# Altium project demo_dermis_chip1_package.PrjPcb
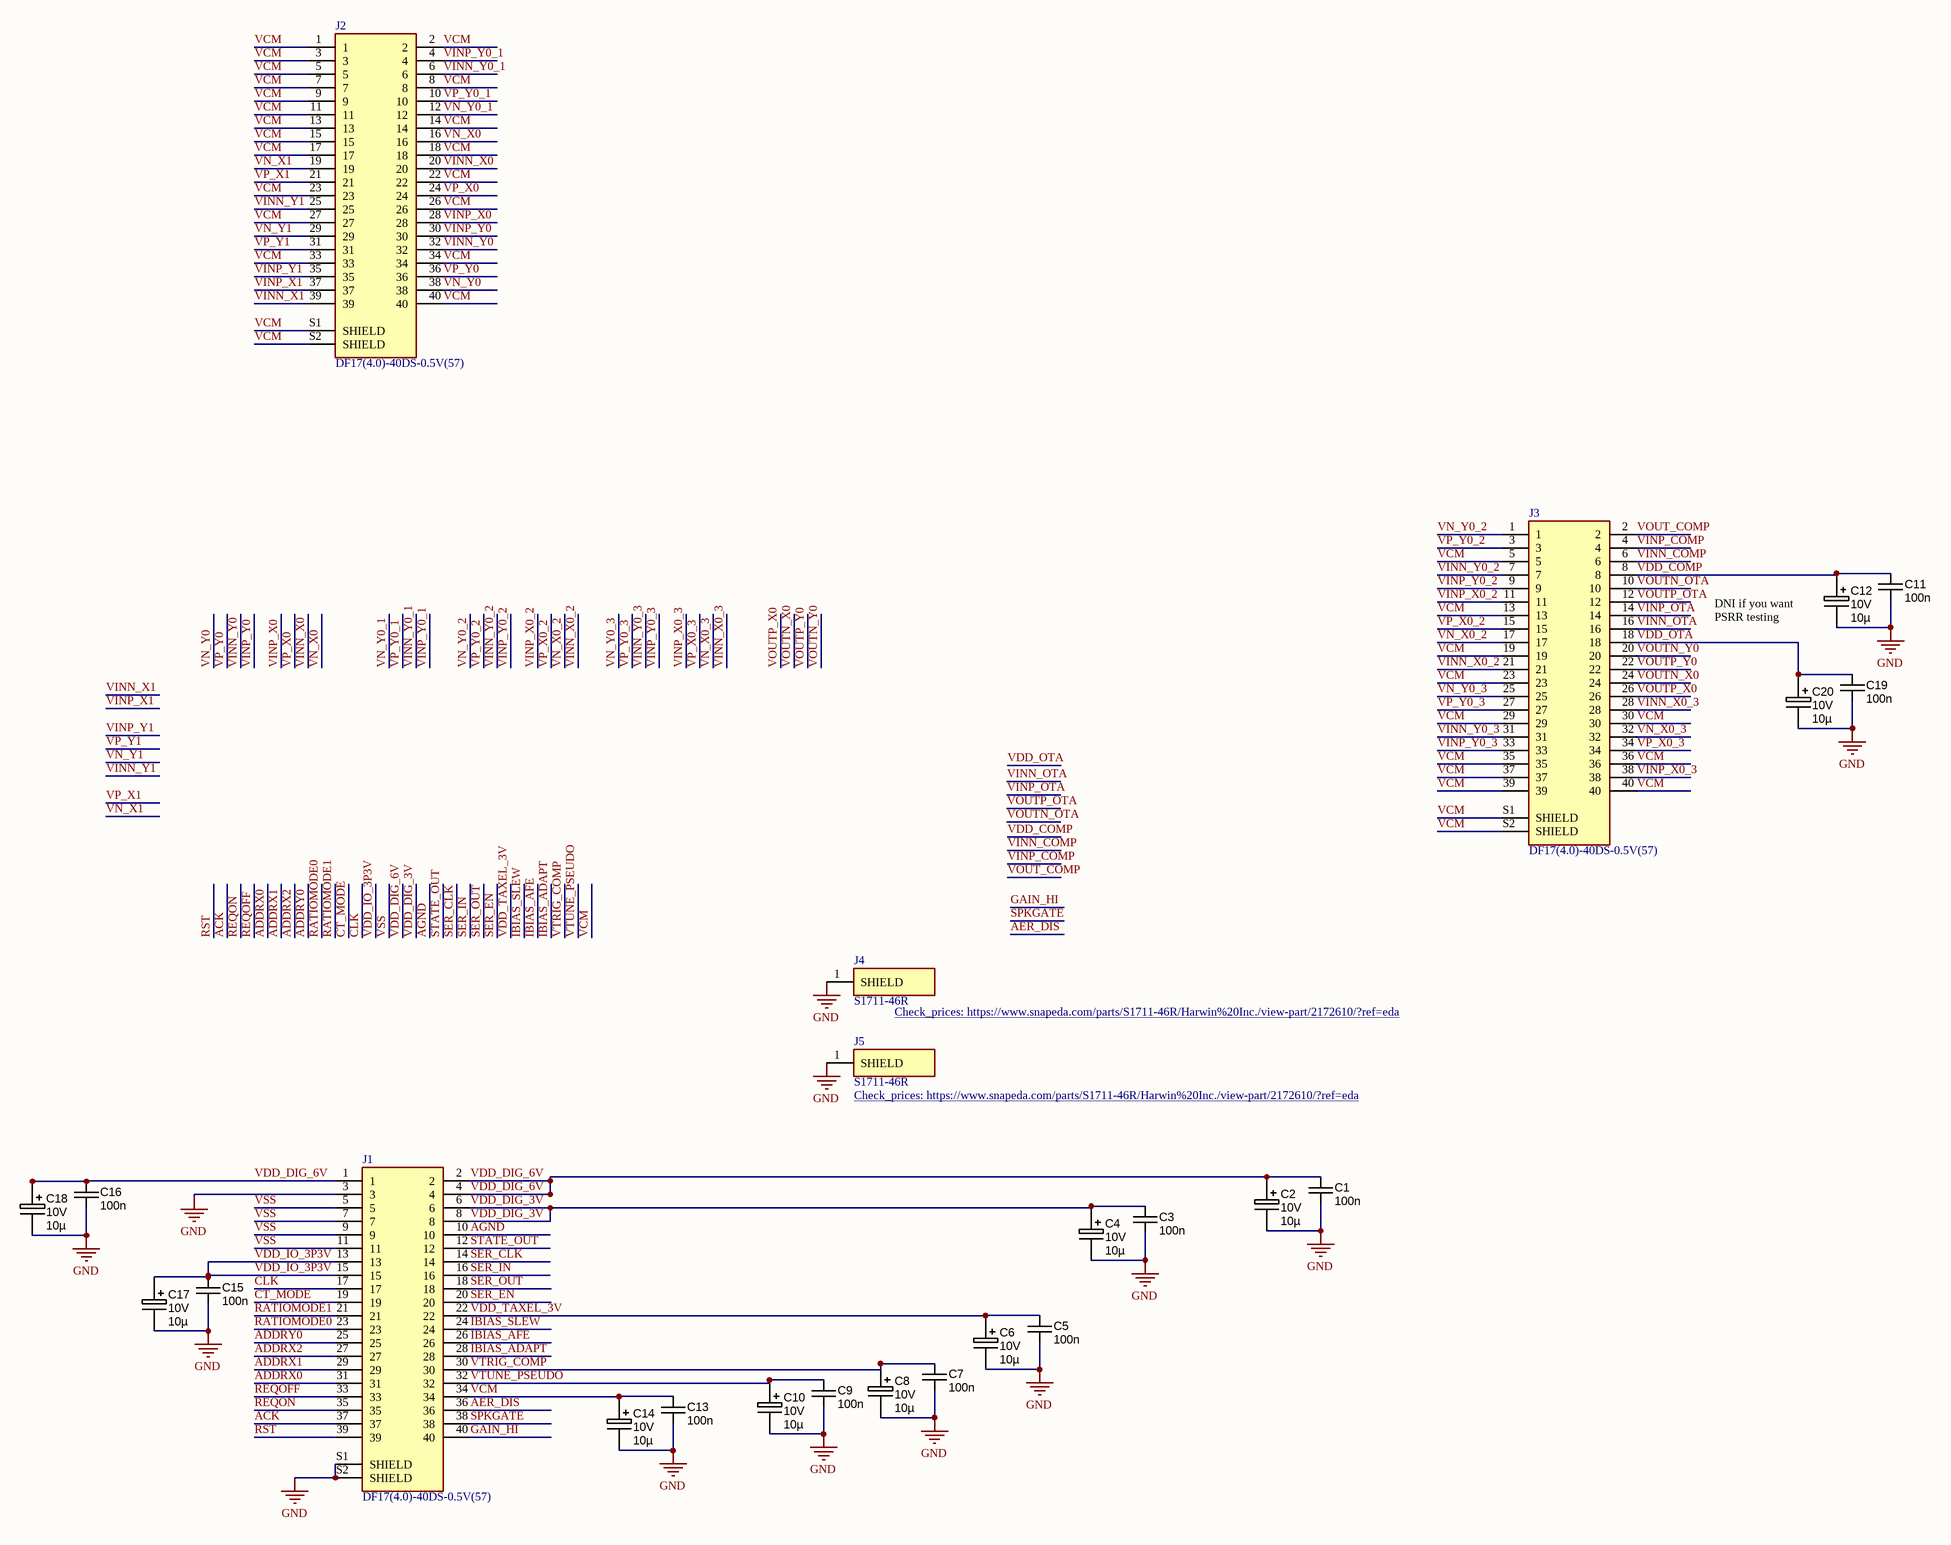
[diagram p0: demo_dermis_chip1_package.SchDoc]
1 sheet, 25 parts. Net scope: global (net labels, ports and power ports of the same name join across sheets).
Board file: demo_dermis_chip1_package.PcbDoc

## Sheet demo_dermis_chip1_package.SchDoc
size C

### Parts
C1  value 100n  [CAPC1608N]  (hidden comment: approved sub OK)
C2  Ratings: 10V  [CAPMP2012X150USR]  (hidden comment: 10µ)
C3  value 100n  [CAPC1608N]  (hidden comment: approved sub OK)
C4  Ratings: 10V  [CAPMP2012X150USR]  (hidden comment: 10µ)
C5  value 100n  [CAPC1608N]  (hidden comment: approved sub OK)
C6  Ratings: 10V  [CAPMP2012X150USR]  (hidden comment: 10µ)
C7  value 100n  [CAPC1608N]  (hidden comment: approved sub OK)
C8  Ratings: 10V  [CAPMP2012X150USR]  (hidden comment: 10µ)
C9  value 100n  [CAPC1608N]  (hidden comment: approved sub OK)
C10  Ratings: 10V  [CAPMP2012X150USR]  (hidden comment: 10µ)
C11  value 100n  [CAPC1608N]  (hidden comment: approved sub OK)
C12  Ratings: 10V  [CAPMP2012X150USR]  (hidden comment: 10µ)
C13  value 100n  [CAPC1608N]  (hidden comment: approved sub OK)
C14  Ratings: 10V  [CAPMP2012X150USR]  (hidden comment: 10µ)
C15  value 100n  [CAPC1608N]  (hidden comment: approved sub OK)
C16  value 100n  [CAPC1608N]  (hidden comment: approved sub OK)
C17  Ratings: 10V  [CAPMP2012X150USR]  (hidden comment: 10µ)
C18  Ratings: 10V  [CAPMP2012X150USR]  (hidden comment: 10µ)
C19  value 100n  [CAPC1608N]  (hidden comment: approved sub OK)
C20  Ratings: 10V  [CAPMP2012X150USR]  (hidden comment: 10µ)
J1  DF17(4.0)-40DS-0.5V(57)  [HRS_DF17(4.0)-40DS-0.5V(57)]
J2  DF17(4.0)-40DS-0.5V(57)  [HRS_DF17(4.0)-40DS-0.5V(57)]
J3  DF17(4.0)-40DS-0.5V(57)  [HRS_DF17(4.0)-40DS-0.5V(57)]
J4  S1711-46R  [HARWIN_S1711-46R]
J5  S1711-46R  [HARWIN_S1711-46R]

### Nets
GND: C1.2 C2.2 C3.2 C4.2 C5.2 C6.2 C7.2 C8.2 C9.2 C10.2 C11.2 C12.2 C13.2 C14.2 C15.2 C16.2 C17.2 C18.2 C19.2 C20.2 J1.3 J1.S1(SHIELD) J1.S2(SHIELD) J4.1(SHIELD) J5.1(SHIELD)
ACK: J1.37
ADDRX0: J1.31
ADDRX1: J1.29
ADDRX2: J1.27
ADDRY0: J1.25
AER_DIS: J1.36
AGND: J1.10
CLK: J1.17
CT_MODE: J1.19
GAIN_HI: J1.40
IBIAS_ADAPT: J1.28
IBIAS_AFE: J1.26
IBIAS_SLEW: J1.24
RATIOMODE0: J1.23
RATIOMODE1: J1.21
REQOFF: J1.33
REQON: J1.35
RST: J1.39
SER_CLK: J1.14
SER_EN: J1.20
SER_IN: J1.16
SER_OUT: J1.18
SPKGATE: J1.38
STATE_OUT: J1.12
VCM: C13.1 C14.1 J1.34 J2.1 J2.2 J2.3 J2.5 J2.7 J2.8 J2.9 J2.11 J2.13 J2.14 J2.15 J2.17 J2.18 J2.22 J2.23 J2.26 J2.27 J2.33 J2.34 J2.40 J2.S1(SHIELD) J2.S2(SHIELD) J3.5 J3.13 J3.19 J3.23 J3.29 J3.30 J3.35 J3.36 J3.37 J3.39 J3.40 J3.S1(SHIELD) J3.S2(SHIELD)
VDD_COMP: C11.1 C12.1 J3.8
VDD_DIG_3V: C3.1 C4.1 J1.6 J1.8
VDD_DIG_6V: C1.1 C2.1 C16.1 C18.1 J1.1 J1.2 J1.4
VDD_IO_3P3V: C15.1 C17.1 J1.13 J1.15
VDD_OTA: C19.1 C20.1 J3.18
VDD_TAXEL_3V: C5.1 C6.1 J1.22
VINN_COMP: J3.6
VINN_OTA: J3.16
VINN_X0: J2.20
VINN_X0_2: J3.21
VINN_X0_3: J3.28
VINN_X1: J2.39
VINN_Y0: J2.32
VINN_Y0_1: J2.6
VINN_Y0_2: J3.7
VINN_Y0_3: J3.31
VINN_Y1: J2.25
VINP_COMP: J3.4
VINP_OTA: J3.14
VINP_X0: J2.28
VINP_X0_2: J3.11
VINP_X0_3: J3.38
VINP_X1: J2.37
VINP_Y0: J2.30
VINP_Y0_1: J2.4
VINP_Y0_2: J3.9
VINP_Y0_3: J3.33
VINP_Y1: J2.35
VN_X0: J2.16
VN_X0_2: J3.17
VN_X0_3: J3.32
VN_X1: J2.19
VN_Y0: J2.38
VN_Y0_1: J2.12
VN_Y0_2: J3.1
VN_Y0_3: J3.25
VN_Y1: J2.29
VOUT_COMP: J3.2
VOUTN_OTA: J3.10
VOUTN_X0: J3.24
VOUTN_Y0: J3.20
VOUTP_OTA: J3.12
VOUTP_X0: J3.26
VOUTP_Y0: J3.22
VP_X0: J2.24
VP_X0_2: J3.15
VP_X0_3: J3.34
VP_X1: J2.21
VP_Y0: J2.36
VP_Y0_1: J2.10
VP_Y0_2: J3.3
VP_Y0_3: J3.27
VP_Y1: J2.31
VSS: J1.5 J1.7 J1.9 J1.11
VTRIG_COMP: C7.1 C8.1 J1.30
VTUNE_PSEUDO: C9.1 C10.1 J1.32

### Notes on the sheet
- (near C12) DNI if you want PSRR testing
- Title
- Size:
- Date:
- File:
- C
- Number:
- Time:
- Revision:
- Sheet
- of

### Library data of the parts
C1 C3 C5 C7 C9 C11 C13 C15 C16 C19 = CAPC_100n_0603: Capacitor SMD Cer 100nF 10% 50V X7R 0603; Manufacturer 1: AVX Corporation; Manufacturer Part Number 1: 06035C104KAT2A; Ratings: 50V; X7R; Material: ceramic; Manufacturer 2: TDK Corporation; Manufacturer Part Number 2: C1608X7R1H104K; Package / Case: 0603 (1608 Metric); Tolerance: ±10%; Supplier 1: Digi-Key; Supplier Part Number 1: 478-5052-1-ND; ComponentLink1URL: http://www.avx.com/docs/Catalogs/cx7r.pdf; ComponentLink1Description: http://www.avx.com/docs/Catalogs/cx7r.pdf; Supplier 2: Digi-Key; Supplier Part Number 2: 445-1314-1-ND; ComponentLink2URL: http://product.tdk.com/capacitor/mlcc/en/documents/mlcc_commercial_general_en.pdf; ComponentLink2Description: http://product.tdk.com/capacitor/mlcc/en/documents/mlcc_commercial_general_en.pdf
C2 C4 C6 C8 C10 C12 C14 C17 C18 C20 = CAPT_10u_0805_10V: Capacitor SMD Tantalum 10uF 20% 10V 0805; Manufacturer 1: AVX Corporation; Manufacturer Part Number 1: TAJP106M010RNJ; Package / Case: 0805 (2012 metric); Tolerance: ±20%; Material: Tantalum; Supplier 1: Digi-Key; Supplier Part Number 1: 478-3281-1-ND; Value: 10µ
J1-J3 = DF17(4.0)-40DS-0.5V(57): recept, PC Board, Headers & Receptacles, gold, fit, straight, metal, pos, Connectors and Adapters, connector, Connect...; MF: Hirose Electric; SnapEDA_Link: https://www.snapeda.com/parts/DF17(4.0)-40DS-0.5V(57)/Hirose+Electric+Co+Ltd/view-part/?ref=snap; Package: None; MP: DF17(4.0)-40DS-0.5V(57); Check_prices: https://www.snapeda.com/parts/DF17(4.0)-40DS-0.5V(57)/Hirose+Electric+Co+Ltd/view-part/?ref=eda; Purchase-URL: https://pricing.snapeda.com/search/part/DF17(4.0)-40DS-0.5V(57)/?ref=eda; Price: None; Value: *; Availability: In Stock
J4 J5 = S1711-46R: RFI SHIELD CLIP TIN SMD; MF: Harwin Inc.; Purchase-URL: https://pricing.snapeda.com/search/part/S1711-46R/?ref=eda; MP: S1711-46R; SnapEDA_Link: https://www.snapeda.com/parts/S1711-46R/Harwin%20Inc./view-part/2172610/?ref=snap; Price: None; Package: None; Value: *; Availability: Warning; Check_prices: https://www.snapeda.com/parts/S1711-46R/Harwin%20Inc./view-part/2172610/?ref=eda